# Altium schematic sheet Power.SchDoc
size A4
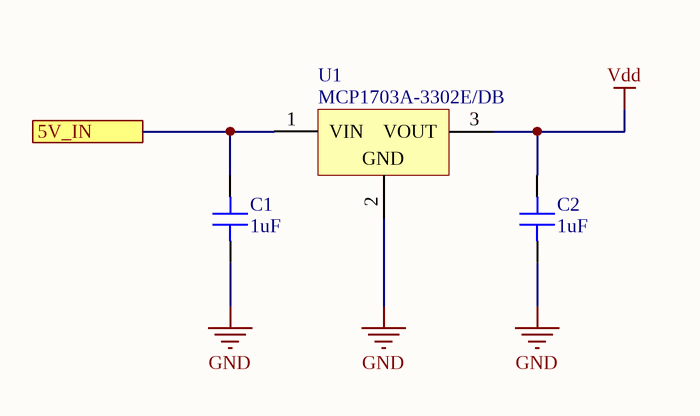
[diagram p0: Power.SchDoc]

## Parts
C1  1uF  [CAP 0603_1608]
C2  1uF  [CAP 0603_1608]
U1  MCP1703A-3302E/DB  [MCHP-SOT-223-DB3_N]

## Ports
5V_IN

## Nets
GND: C1.1 C2.1 U1.2(GND)
Vdd: C2.2 U1.3(VOUT)
5V_IN: C1.2 U1.1(VIN) ; port 5V_IN

## Library data of the parts
C1 C2 = Capacitor: SMT Capacitor
U1 = CMP-0136-01118-1: 250 mA, 16 V, Low Quiescent Current LDO Regulator, -40 to 125 degC, 3-pin SOT-223 (DB3), Tube; Manufacturer: Microchip; ComponentLink3Description: Package Specification; PackageVersion: C04-032B; ComponentLink1URL: http://www.microchip.com; PartNumber: MCP1703A-3302E/DB; ComponentLink4URL: http://www.microchip.com/MCP1703A; PackageDescription: 3-Lead Plastic Small Outline Transistor, 6.5 x 3.5 mm Body, 2.3 mm Pitch; PackageReference: SOT-223-DB3; DatasheetVersion: Rev. A; Mounting Technology: Surface Mount; ComponentLink4Description: Product URL; ComponentLink2Description: Datasheet; ComponentLink1Description: Manufacturer URL; ComponentLink3URL: http://www.microchip.com/stellent/groups/techpub_sg/documents/packagingspec/en012702.pdf; ComponentLink2URL: http://ww1.microchip.com/downloads/en/DeviceDoc/25122A.pdf